# Altium schematic sheet A3000_16MB_M3.SchDoc: ARM2 to ARM3 Adapter
size A3; DocumentNumber: 1; SheetNumber: 4; SheetTotal: 5
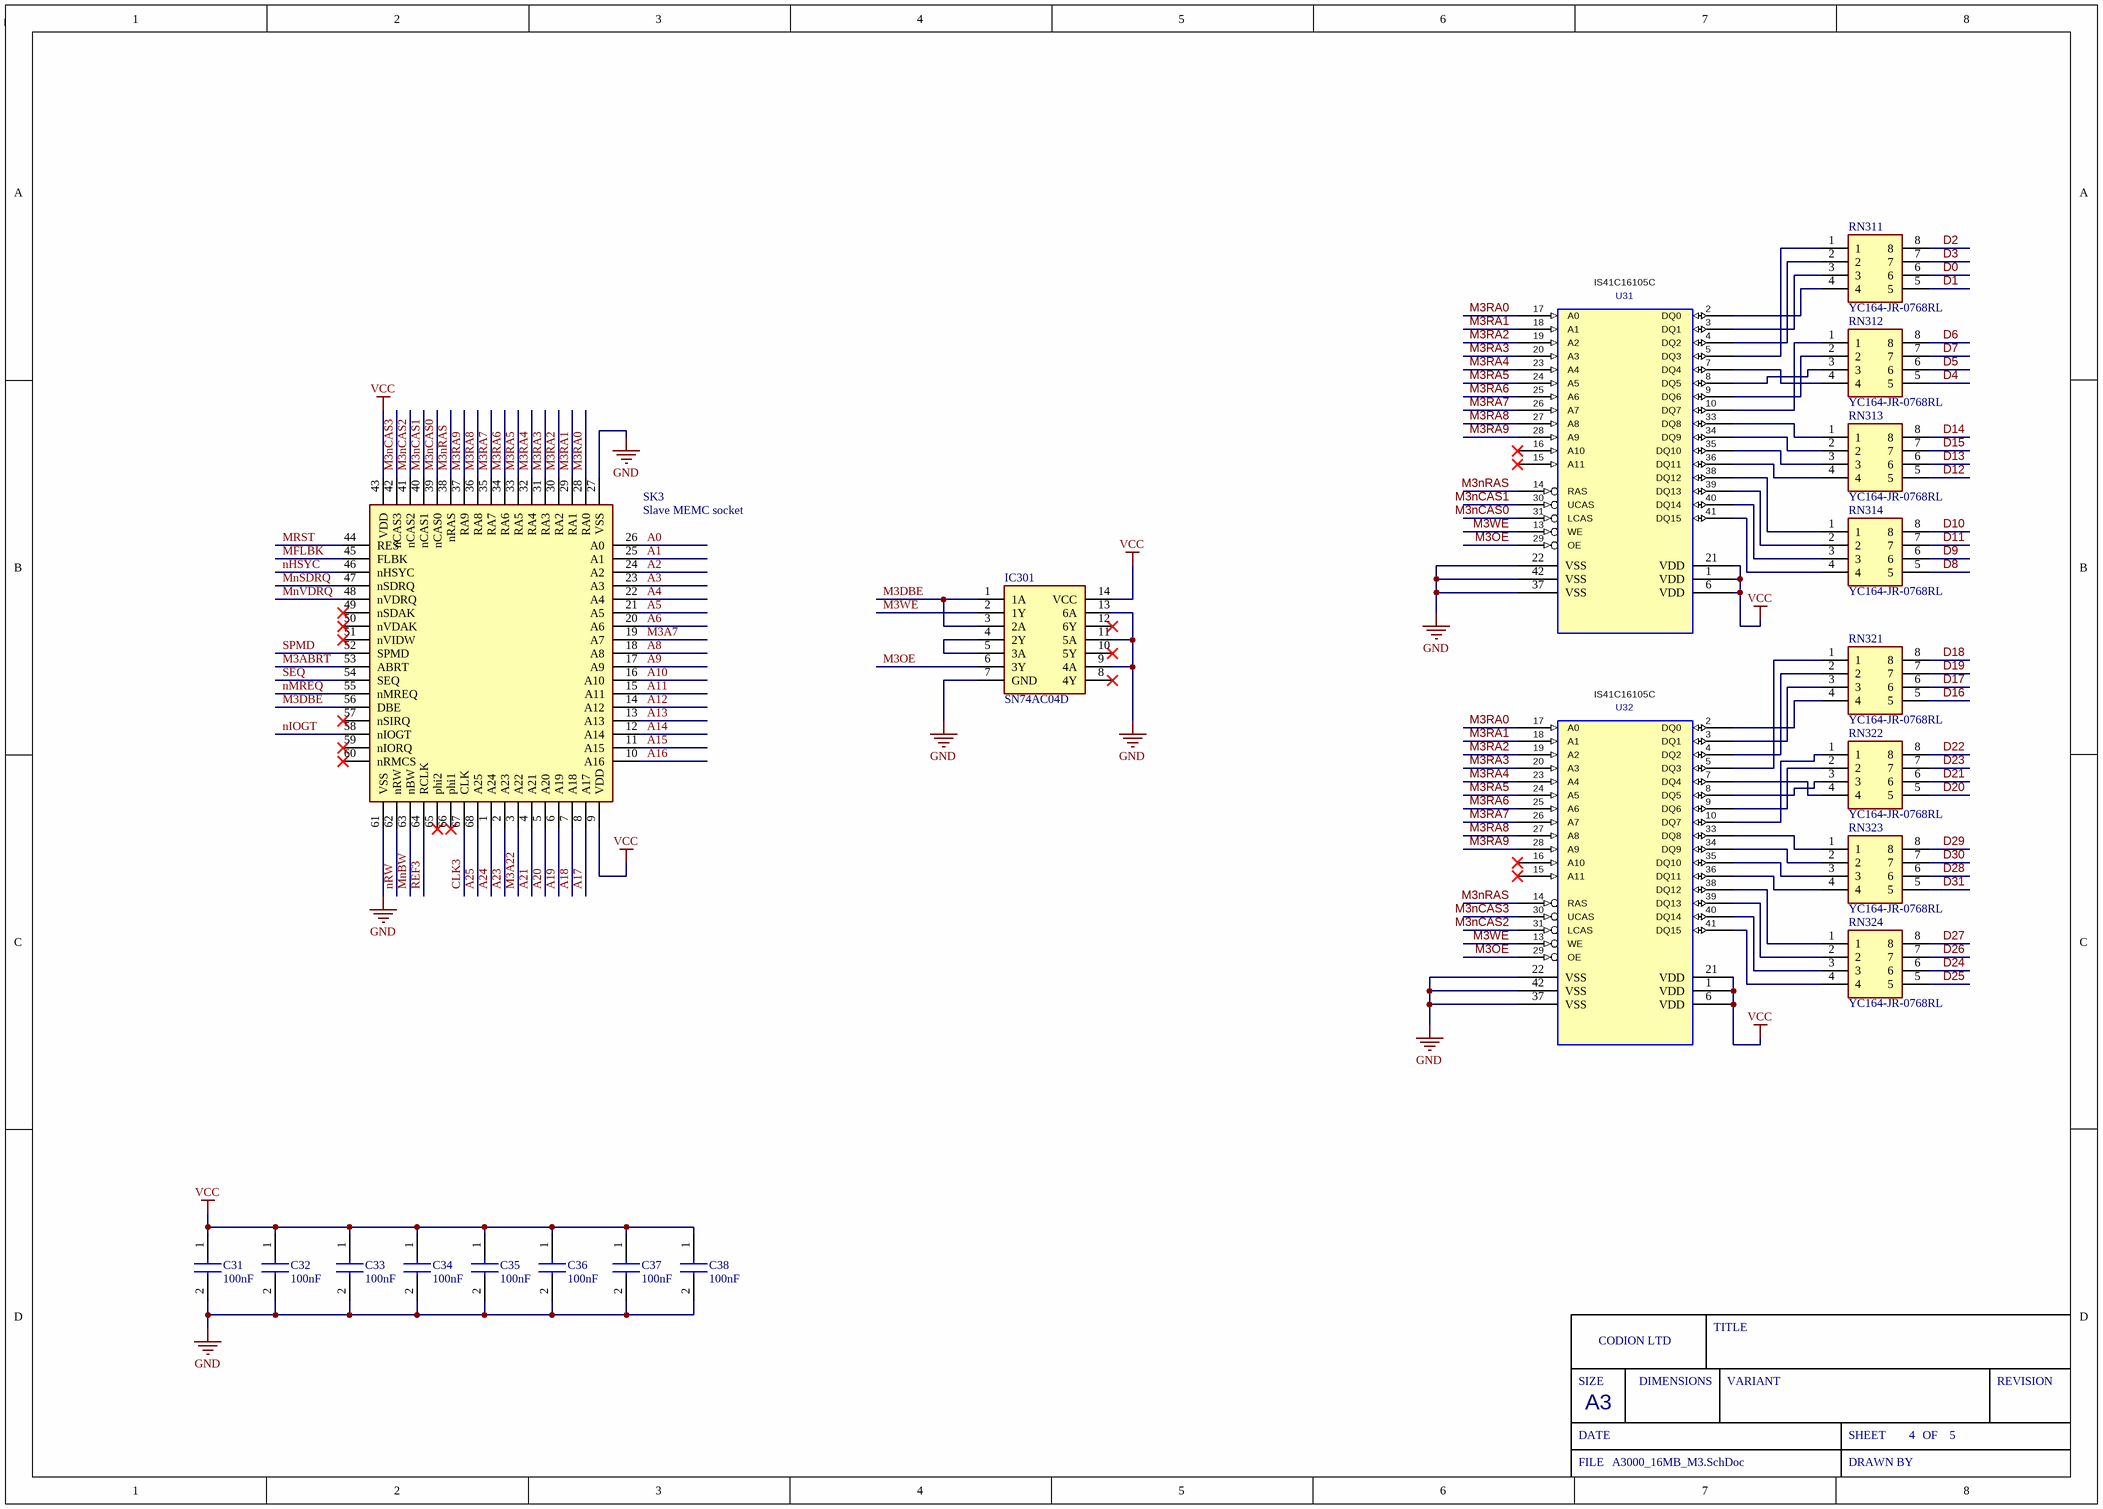
[diagram p0: A3000_16MB_M3.SchDoc]

## Parts
C31  100nF  [CAPC2012X145N]
C32  100nF  [CAPC2012X145N]
C33  100nF  [CAPC2012X145N]
C34  100nF  [CAPC2012X145N]
C35  100nF  [CAPC2012X145N]
C36  100nF  [CAPC2012X145N]
C37  100nF  [CAPC2012X145N]
C38  100nF  [CAPC2012X145N]
IC301  SN74AC04D  [SOIC127P600X175-14N]
RN311  YC164-JR-0768RL  [YC164JR0768RL]
RN312  YC164-JR-0768RL  [YC164JR0768RL]
RN313  YC164-JR-0768RL  [YC164JR0768RL]
RN314  YC164-JR-0768RL  [YC164JR0768RL]
RN321  YC164-JR-0768RL  [YC164JR0768RL]
RN322  YC164-JR-0768RL  [YC164JR0768RL]
RN323  YC164-JR-0768RL  [YC164JR0768RL]
RN324  YC164-JR-0768RL  [YC164JR0768RL]
SK3  Slave MEMC socket  [MEMC_Socket]
U31  IS41C16105C  [SOJ-42]
U32  IS41C16105C  [SOJ-42]

## Nets
GND: C31.2 C32.2 C33.2 C34.2 C35.2 C36.2 C37.2 C38.2 IC301.7(GND) IC301.9(4A) IC301.11(5A) IC301.13(6A) SK3.27(VSS) SK3.61(VSS) U31.22(VSS) U31.37(VSS) U31.42(VSS) U32.22(VSS) U32.37(VSS) U32.42(VSS)
VCC: C31.1 C32.1 C33.1 C34.1 C35.1 C36.1 C37.1 C38.1 IC301.14(VCC) SK3.9(VDD) SK3.43(VDD) U31.1(VCC) U31.6(VCC) U31.21(VCC) U32.1(VCC) U32.6(VCC) U32.21(VCC)
A0: SK3.26(A0)
A1: SK3.25(A1)
A2: SK3.24(A2)
A3: SK3.23(A3)
A4: SK3.22(A4)
A5: SK3.21(A5)
A6: SK3.20(A6)
A8: SK3.18(A8)
A9: SK3.17(A9)
A10: SK3.16(A10)
A11: SK3.15(A11)
A12: SK3.14(A12)
A13: SK3.13(A13)
A14: SK3.12(A14)
A15: SK3.11(A15)
A16: SK3.10(A16)
A17: SK3.8(A17)
A18: SK3.7(A18)
A19: SK3.6(A19)
A20: SK3.5(A20)
A21: SK3.4(A21)
A23: SK3.2(A23)
A24: SK3.1(A24)
A25: SK3.68(A25)
CLK3: SK3.67(CLK)
D0: RN311.6
D1: RN311.5
D2: RN311.8
D3: RN311.7
D4: RN312.5
D5: RN312.6
D6: RN312.8
D7: RN312.7
D8: RN314.5
D9: RN314.6
D10: RN314.8
D11: RN314.7
D12: RN313.5
D13: RN313.6
D14: RN313.8
D15: RN313.7
D16: RN321.5
D17: RN321.6
D18: RN321.8
D19: RN321.7
D20: RN322.5
D21: RN322.6
D22: RN322.8
D23: RN322.7
D24: RN324.6
D25: RN324.5
D26: RN324.7
D27: RN324.8
D28: RN323.6
D29: RN323.8
D30: RN323.7
D31: RN323.5
M3A7: SK3.19(A7)
M3A22: SK3.3(A22)
M3ABRT: SK3.53(ABRT)
M3DBE: IC301.1(1A) IC301.3(2A) SK3.56(DBE)
M3nCAS0: SK3.39(nCAS0) U31.31(LCAS)
M3nCAS1: SK3.40(nCAS1) U31.30(UCAS)
M3nCAS2: SK3.41(nCAS2) U32.31(LCAS)
M3nCAS3: SK3.42(nCAS3) U32.30(UCAS)
M3nRAS: SK3.38(nRAS) U31.14(RAS) U32.14(RAS)
M3OE: IC301.6(3Y) U31.29(OE) U32.29(OE)
M3RA0: SK3.28(RA0) U31.17(A0) U32.17(A0)
M3RA1: SK3.29(RA1) U31.18(A1) U32.18(A1)
M3RA2: SK3.30(RA2) U31.19(A2) U32.19(A2)
M3RA3: SK3.31(RA3) U31.20(A3) U32.20(A3)
M3RA4: SK3.32(RA4) U31.23(A4) U32.23(A4)
M3RA5: SK3.33(RA5) U31.24(A5) U32.24(A5)
M3RA6: SK3.34(RA6) U31.25(A6) U32.25(A6)
M3RA7: SK3.35(RA7) U31.26(A7) U32.26(A7)
M3RA8: SK3.36(RA8) U31.27(A8) U32.27(A8)
M3RA9: SK3.37(RA9) U31.28(A9) U32.28(A9)
M3WE: IC301.2(1Y) U31.13(WE) U32.13(WE)
MFLBK: SK3.45(FLBK)
MnBW: SK3.63(nBW)
MnSDRQ: SK3.47(nSDRQ)
MnVDRQ: SK3.48(nVDRQ)
MRST: SK3.44(RES)
nHSYC: SK3.46(nHSYC)
nIOGT: SK3.58(nIOGT)
nMREQ: SK3.55(nMREQ)
nRW: SK3.62(nRW)
REF3: SK3.64(RCLK)
SEQ: SK3.54(SEQ)
SPMD: SK3.52(SPMD)
NetIC301_4: IC301.4(2Y) IC301.5(3A)
NetRN311_1: RN311.1 U31.5(DQ3)
NetRN311_2: RN311.2 U31.4(DQ2)
NetRN311_3: RN311.3 U31.3(DQ1)
NetRN311_4: RN311.4 U31.2(DQ0)
NetRN312_1: RN312.1 U31.10(DQ7)
NetRN312_2: RN312.2 U31.9(DQ6)
NetRN312_3: RN312.3 U31.8(DQ5)
NetRN312_4: RN312.4 U31.7(DQ4)
NetRN313_1: RN313.1 U31.33(DQ8)
NetRN313_2: RN313.2 U31.34(DQ9)
NetRN313_3: RN313.3 U31.35(DQ10)
NetRN313_4: RN313.4 U31.36(DQ11)
NetRN314_1: RN314.1 U31.38(DQ12)
NetRN314_2: RN314.2 U31.39(DQ13)
NetRN314_3: RN314.3 U31.40(DQ14)
NetRN314_4: RN314.4 U31.41(DQ15)
NetRN321_1: RN321.1 U32.5(DQ3)
NetRN321_2: RN321.2 U32.4(DQ2)
NetRN321_3: RN321.3 U32.3(DQ1)
NetRN321_4: RN321.4 U32.2(DQ0)
NetRN322_1: RN322.1 U32.10(DQ7)
NetRN322_2: RN322.2 U32.9(DQ6)
NetRN322_3: RN322.3 U32.8(DQ5)
NetRN322_4: RN322.4 U32.7(DQ4)
NetRN323_1: RN323.1 U32.33(DQ8)
NetRN323_2: RN323.2 U32.34(DQ9)
NetRN323_3: RN323.3 U32.35(DQ10)
NetRN323_4: RN323.4 U32.36(DQ11)
NetRN324_1: RN324.1 U32.38(DQ12)
NetRN324_2: RN324.2 U32.39(DQ13)
NetRN324_3: RN324.3 U32.40(DQ14)
NetRN324_4: RN324.4 U32.41(DQ15)

Not connected (* = marked no-connect by the designer): IC301 8(4Y)* 10(5Y)* 12(6Y)*; SK3 49(nSDAK)* 50(nVDAK)* 51(nVIDW)* 57(nSIRQ)* 59(nIORQ)* 60(nRMCS)* 65(phi2)* 66(phi1)*; U31 15(A11)* 16(A10)*; U32 15(A11)* 16(A10)*

## Notes on the sheet
- SIZE
- CODION LTD
- DIMENSIONS
- TITLE
- VARIANT
- REVISION
- DATE
- A3
- SHEET
- OF
- FILE
- DRAWN BY

## Library data of the parts
C31-C38 = C2012X7R1H104K125AM: Capacitor; Manufacturer_Name: TDK; Datasheet Link: https://product.tdk.com/info/en/catalog/datasheets/mlcc_commercial_midvoltage_en.pdf; Height: 1.45mm; Manufacturer_Part_Number: C2012X7R1H104K125AM; Mouser Part Number: 810-C2012X7R1H104KT5; Mouser Price/Stock: https://www.mouser.com/Search/Refine.aspx?Keyword=810-C2012X7R1H104KT5; Arrow Part Number: C2012X7R1H104K125AM; Arrow Price/Stock: https://www.arrow.com/en/products/c2012x7r1h104k125am/tdk; LCSC Part #: C111492
IC301 = SN74AC04D: Integrated Circuit; Manufacturer_Name: Texas Instruments; Datasheet Link: http://www.ti.com/lit/ds/symlink/sn74ac04.pdf; Height: 1.75mm; Manufacturer_Part_Number: SN74AC04D; Mouser Part Number: 595-SN74AC04D; Mouser Price/Stock: https://www.mouser.co.uk/ProductDetail/Texas-Instruments/SN74AC04D?qs=w32V8uFkMxkvsyMHHacuZw%3D%3D; Arrow Part Number: SN74AC04D; Arrow Price/Stock: https://www.arrow.com/en/products/sn74ac04d/texas-instruments?region=nac; LCSC Part #: C352940
RN311-RN314 RN321-RN324 = YC164-JR-0768RL: Resistor Network; Manufacturer_Name: KEMET; Datasheet Link: https://www.yageo.com/upload/media/product/productsearch/datasheet/rchip/PYu-YC_TC_group_51_RoHS_L_9.pdf; Height: 0.7mm; Manufacturer_Part_Number: YC164-JR-0768RL; Mouser Part Number: 603-YC164-JR-0768RL; Mouser Price/Stock: https://www.mouser.co.uk/ProductDetail/Yageo/YC164-JR-0768RL?qs=8cPjvKtxWv7AOp%2F0jDxI3w%3D%3D; Arrow Part Number: YC164-JR-0768RL; Arrow Price/Stock: https://www.arrow.com/en/products/yc164-jr-0768rl/yageo; LCSC Part #: C695188
SK3 = MEMC_Skt: MEMC socket; Manufacturer_Name: 3M; Manufacturer_Part_Number: 8468-21B1-RK-TR; Datasheet Link: https://www.arrow.com/en/products/8468-21b1-rk-tr/3m; Height: 4.6mm; Mouser Part Number: 517-8468-21B1-RK-TR; Mouser Price/Stock: https://www.mouser.co.uk/ProductDetail/3M-Electronic-Solutions-Division/8468-21B1-RK-TR?qs=X%2F%2F06fXhnJ18zOj3KK47CQ%3D%3D; Arrow Part Number: 8468-21B1-RK-TR; Arrow Price/Stock: https://www.arrow.com/en/products/8468-21b1-rk-tr/3m
U31 U32 = DRAM_1MX16_SOJ: Value: IS41C16105C